# EAGLE design RF-antenna_B (EAGLE 9.2.2)

## Sheet 1 of 4
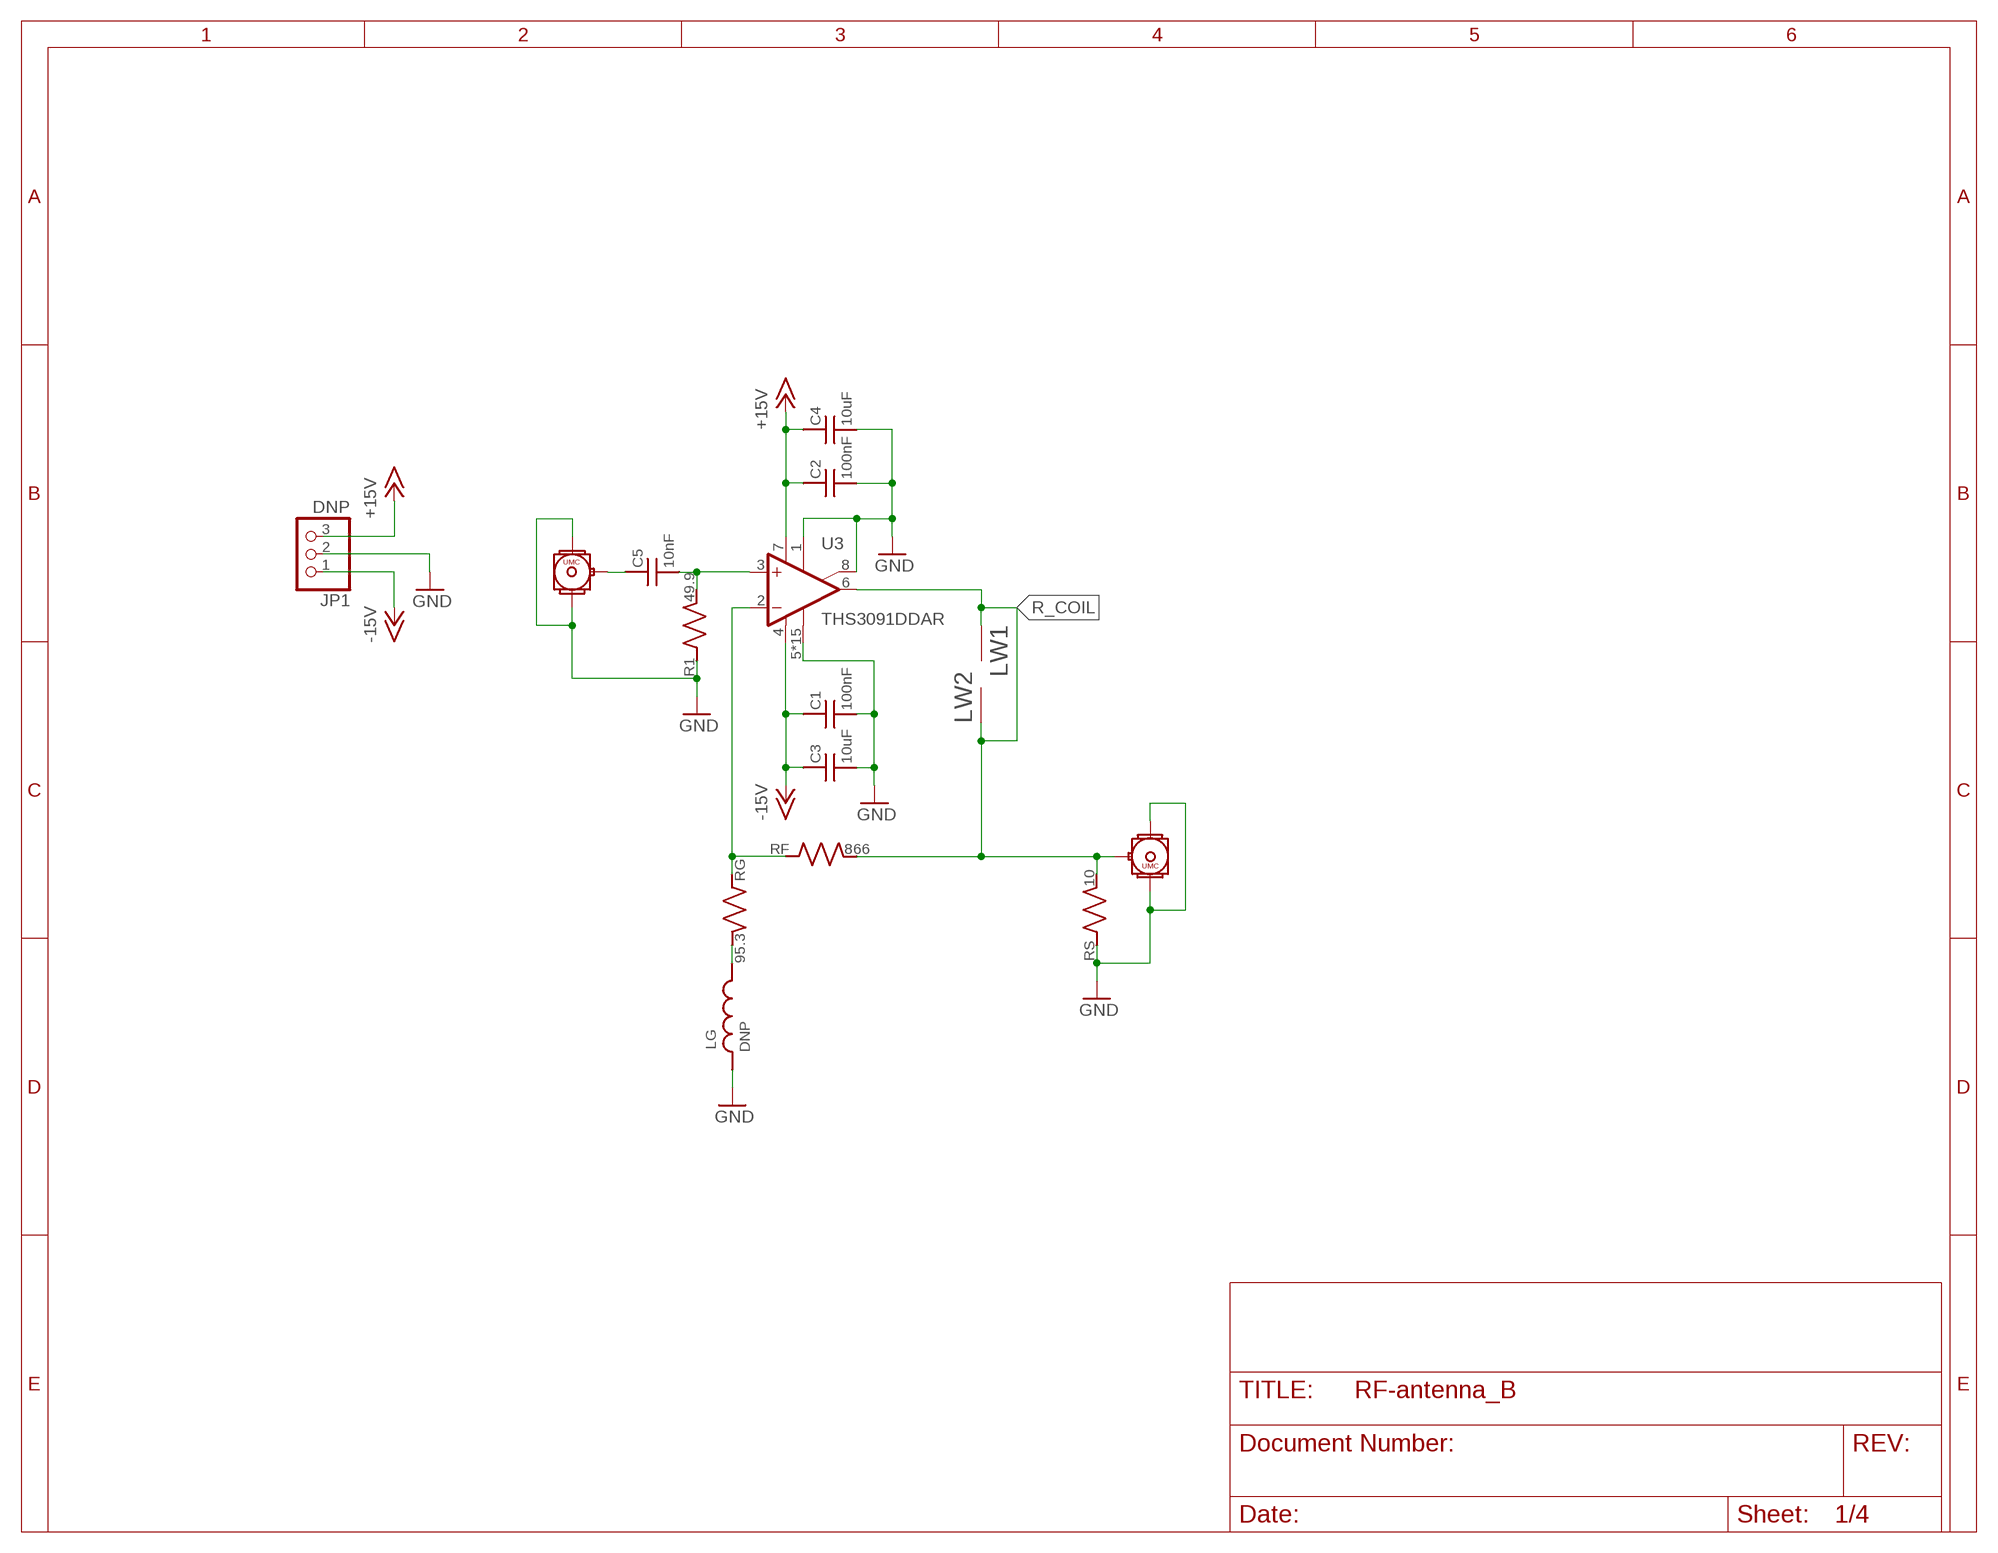
[diagram p0: schematic, sheet 1]

### Parts
C1  100nF  C_MLCC_SMDCMLCC_0603  [C_MLCC_0603]
C2  100nF  C_MLCC_SMDCMLCC_0603  [C_MLCC_0603]
C3  10uF  C_MLCC_SMDCMLCC_1206  [C_MLCC_1206]
C4  10uF  C_MLCC_SMDCMLCC_1206  [C_MLCC_1206]
C5  10nF  C_MLCC_SMDCMLCC_0402  [C_MLCC_0402]
CON1  UMC_CONNECTORREGULAR  [UMC_CONNECTOR]
CON2  UMC_CONNECTORREGULAR  [UMC_CONNECTOR]
JP1  DNP  PINHD-1X3  [1X03]
LG  DNP  L_FERRITE_SMD_1008  [1008]
LW1  LITZ_TERM  [LITZ_100MHZ]
LW2  LITZ_TERM  [LITZ_100MHZ]
R1  49.9  R_SMDR0402  [R_0402]
RF  866  R_SMDR0603  [R_0603]
RG  95.3  R_SMDR0402  [R_0402]
RS  10  R_SMDR1206  [R_1206]
U3  THS3091DDAR  [DDA8_2P28X2P28]

### Nets
+15V: C2.P$1 C4.P$1 JP1.3 U3.7(V+) ; also sheet 2,3
-15V: C1.P$1 C3.P$1 JP1.1 U3.4(V-) ; also sheet 2,3
GND: C1.P$2 C2.P$2 C3.P$2 C4.P$2 CON1.P$2 CON1.P$3 CON2.P$2 CON2.P$3 JP1.2 LG.P$1 R1.P$1 RS.P$1 U3.1(ON1) U3.5(OPT) U3.8(ON2) U3.EPAD(OPT) U3.P$1(OPT) U3.P$2(OPT) U3.P$3(OPT) U3.P$4(OPT) U3.P$5(OPT) U3.P$6(OPT) U3.P$7(OPT) U3.P$8(OPT) U3.P$9(OPT) U3.P$10(OPT) U3.P$11(OPT) U3.P$12(OPT) U3.P$13(OPT) ; also sheet 2,3
N$1: RF.P$1 RG.P$1 U3.2(-IN)
N$3: C5.P$2 R1.P$2 U3.3(+IN)
N$4: C5.P$1 CON2.P$1
N$6: LG.P$2 RG.P$2
R_COIL: CON1.P$1 LW1.T1(P1) LW2.T1(P1) RF.P$2 RS.P$2 U3.6(OUT)

## Sheet 2 of 4
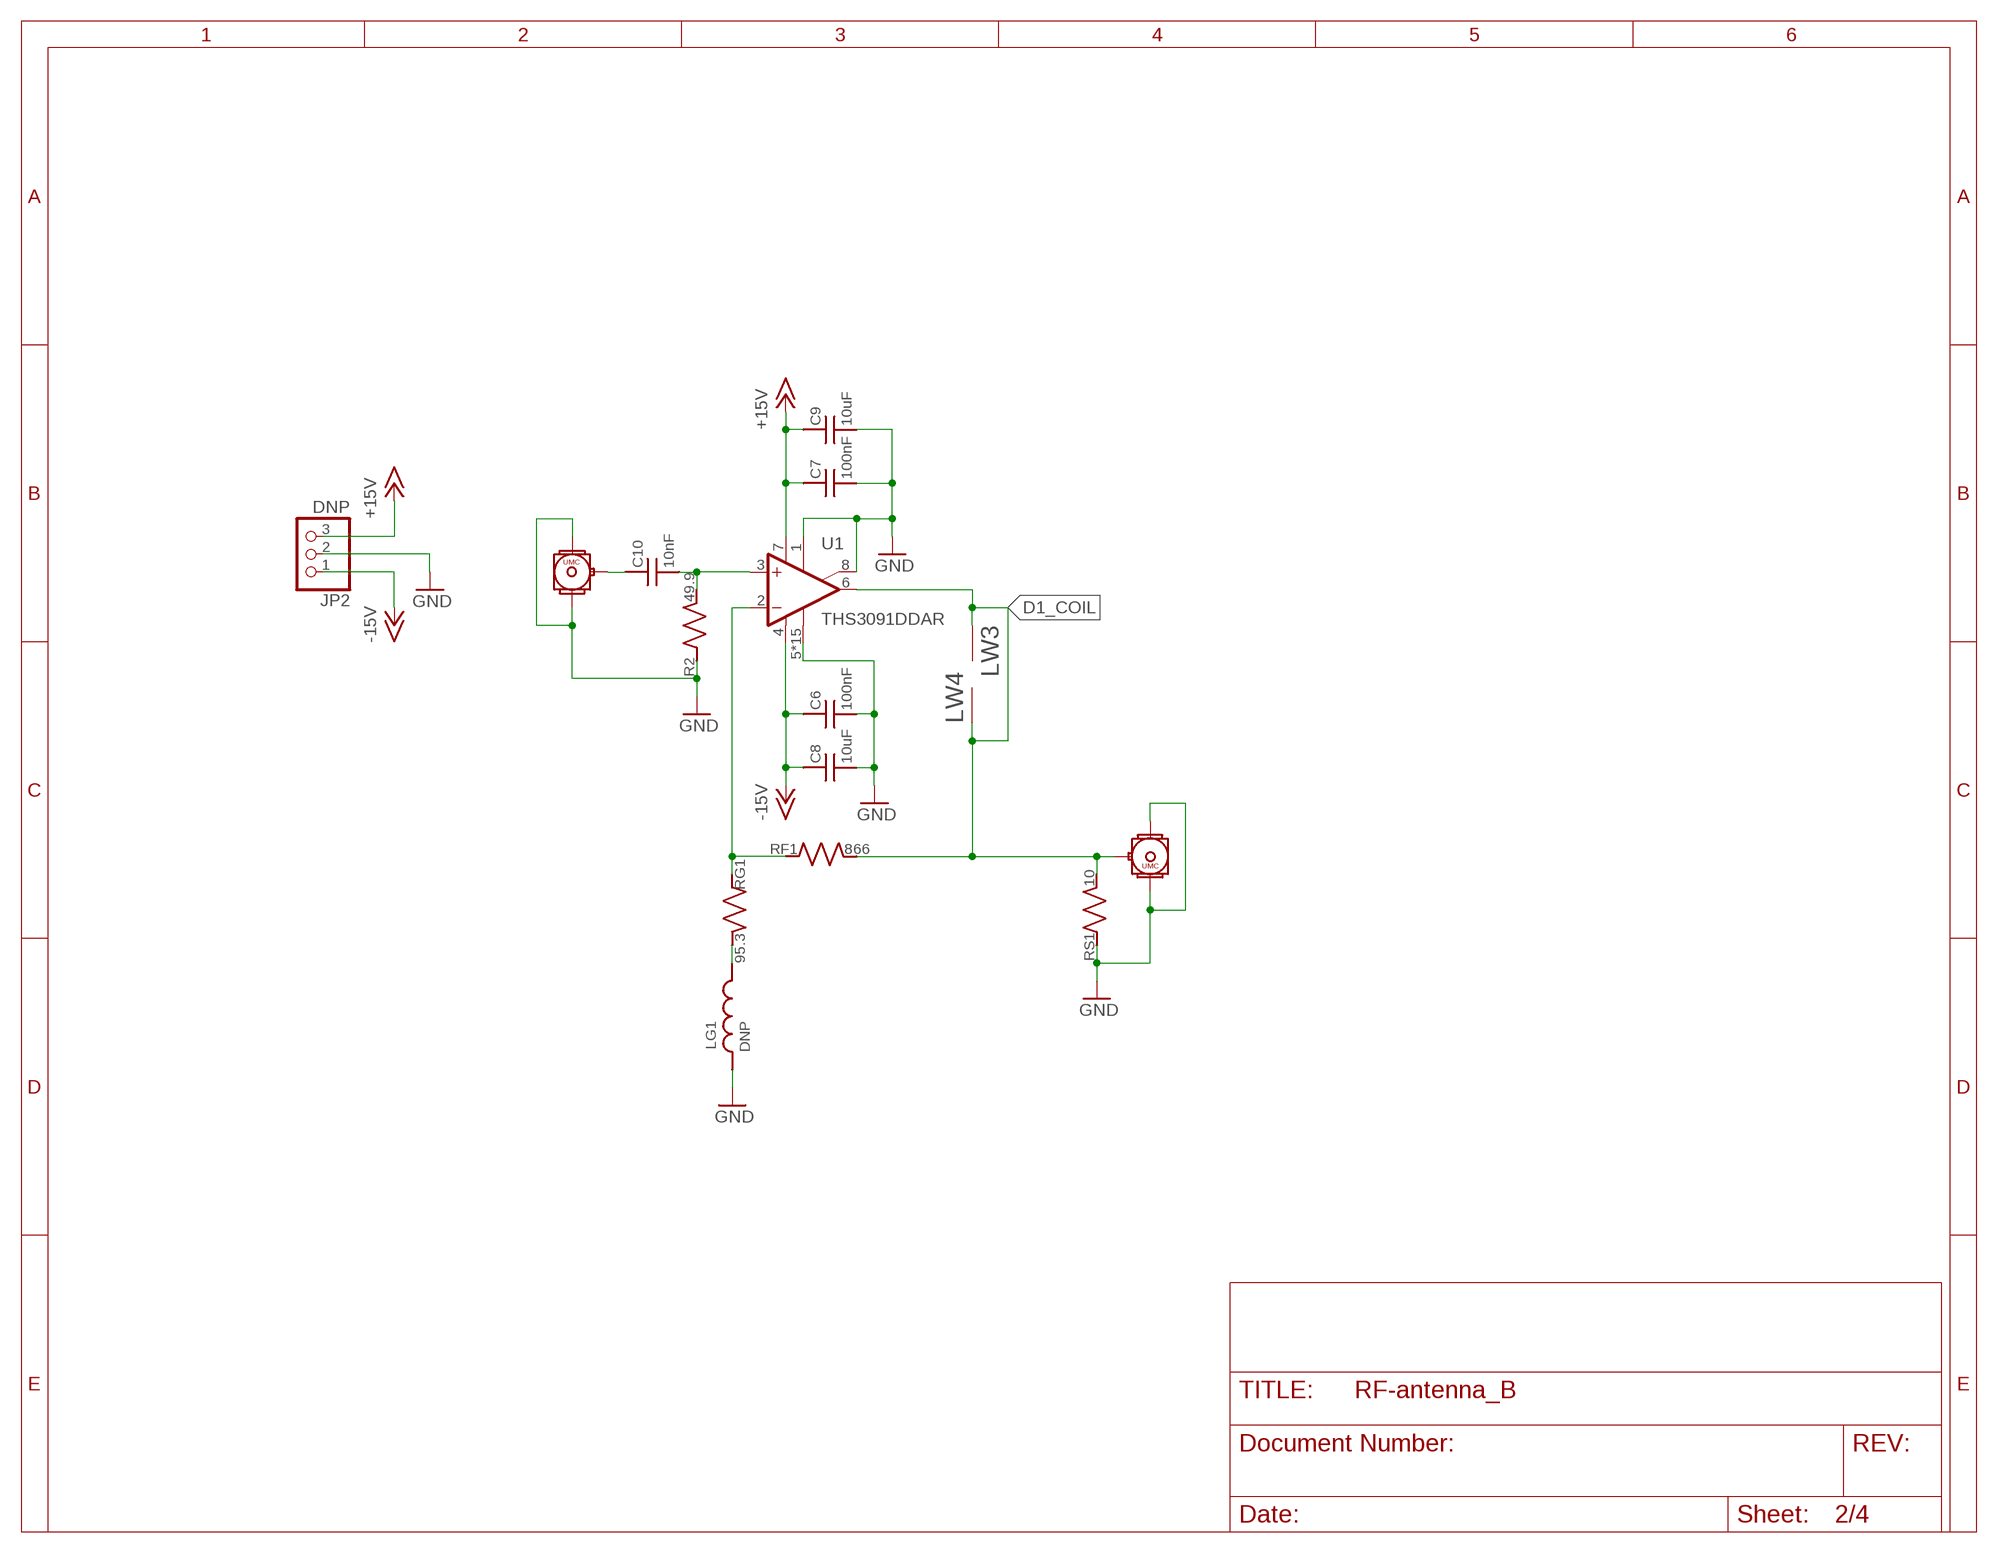
[diagram p1: schematic, sheet 2]

### Parts
C6  100nF  C_MLCC_SMDCMLCC_0603  [C_MLCC_0603]
C7  100nF  C_MLCC_SMDCMLCC_0603  [C_MLCC_0603]
C8  10uF  C_MLCC_SMDCMLCC_1206  [C_MLCC_1206]
C9  10uF  C_MLCC_SMDCMLCC_1206  [C_MLCC_1206]
C10  10nF  C_MLCC_SMDCMLCC_0402  [C_MLCC_0402]
CON3  UMC_CONNECTORREGULAR  [UMC_CONNECTOR]
CON4  UMC_CONNECTORREGULAR  [UMC_CONNECTOR]
JP2  DNP  PINHD-1X3  [1X03]
LG1  DNP  L_FERRITE_SMD_1008  [1008]
LW3  LITZ_TERM  [LITZ_100MHZ]
LW4  LITZ_TERM  [LITZ_100MHZ]
R2  49.9  R_SMDR0402  [R_0402]
RF1  866  R_SMDR0603  [R_0603]
RG1  95.3  R_SMDR0402  [R_0402]
RS1  10  R_SMDR1206  [R_1206]
U1  THS3091DDAR  [DDA8_2P28X2P28]

### Nets
+15V: C7.P$1 C9.P$1 JP2.3 U1.7(V+) ; also sheet 1,3
-15V: C6.P$1 C8.P$1 JP2.1 U1.4(V-) ; also sheet 1,3
D1_COIL: CON4.P$1 LW3.T1(P1) LW4.T1(P1) RF1.P$2 RS1.P$2 U1.6(OUT)
GND: C6.P$2 C7.P$2 C8.P$2 C9.P$2 CON3.P$2 CON3.P$3 CON4.P$2 CON4.P$3 JP2.2 LG1.P$1 R2.P$1 RS1.P$1 U1.1(ON1) U1.5(OPT) U1.8(ON2) U1.EPAD(OPT) U1.P$1(OPT) U1.P$2(OPT) U1.P$3(OPT) U1.P$4(OPT) U1.P$5(OPT) U1.P$6(OPT) U1.P$7(OPT) U1.P$8(OPT) U1.P$9(OPT) U1.P$10(OPT) U1.P$11(OPT) U1.P$12(OPT) U1.P$13(OPT) ; also sheet 1,3
N$5: RF1.P$1 RG1.P$1 U1.2(-IN)
N$7: C10.P$2 R2.P$2 U1.3(+IN)
N$8: C10.P$1 CON3.P$1
N$10: LG1.P$2 RG1.P$2

## Sheet 3 of 4
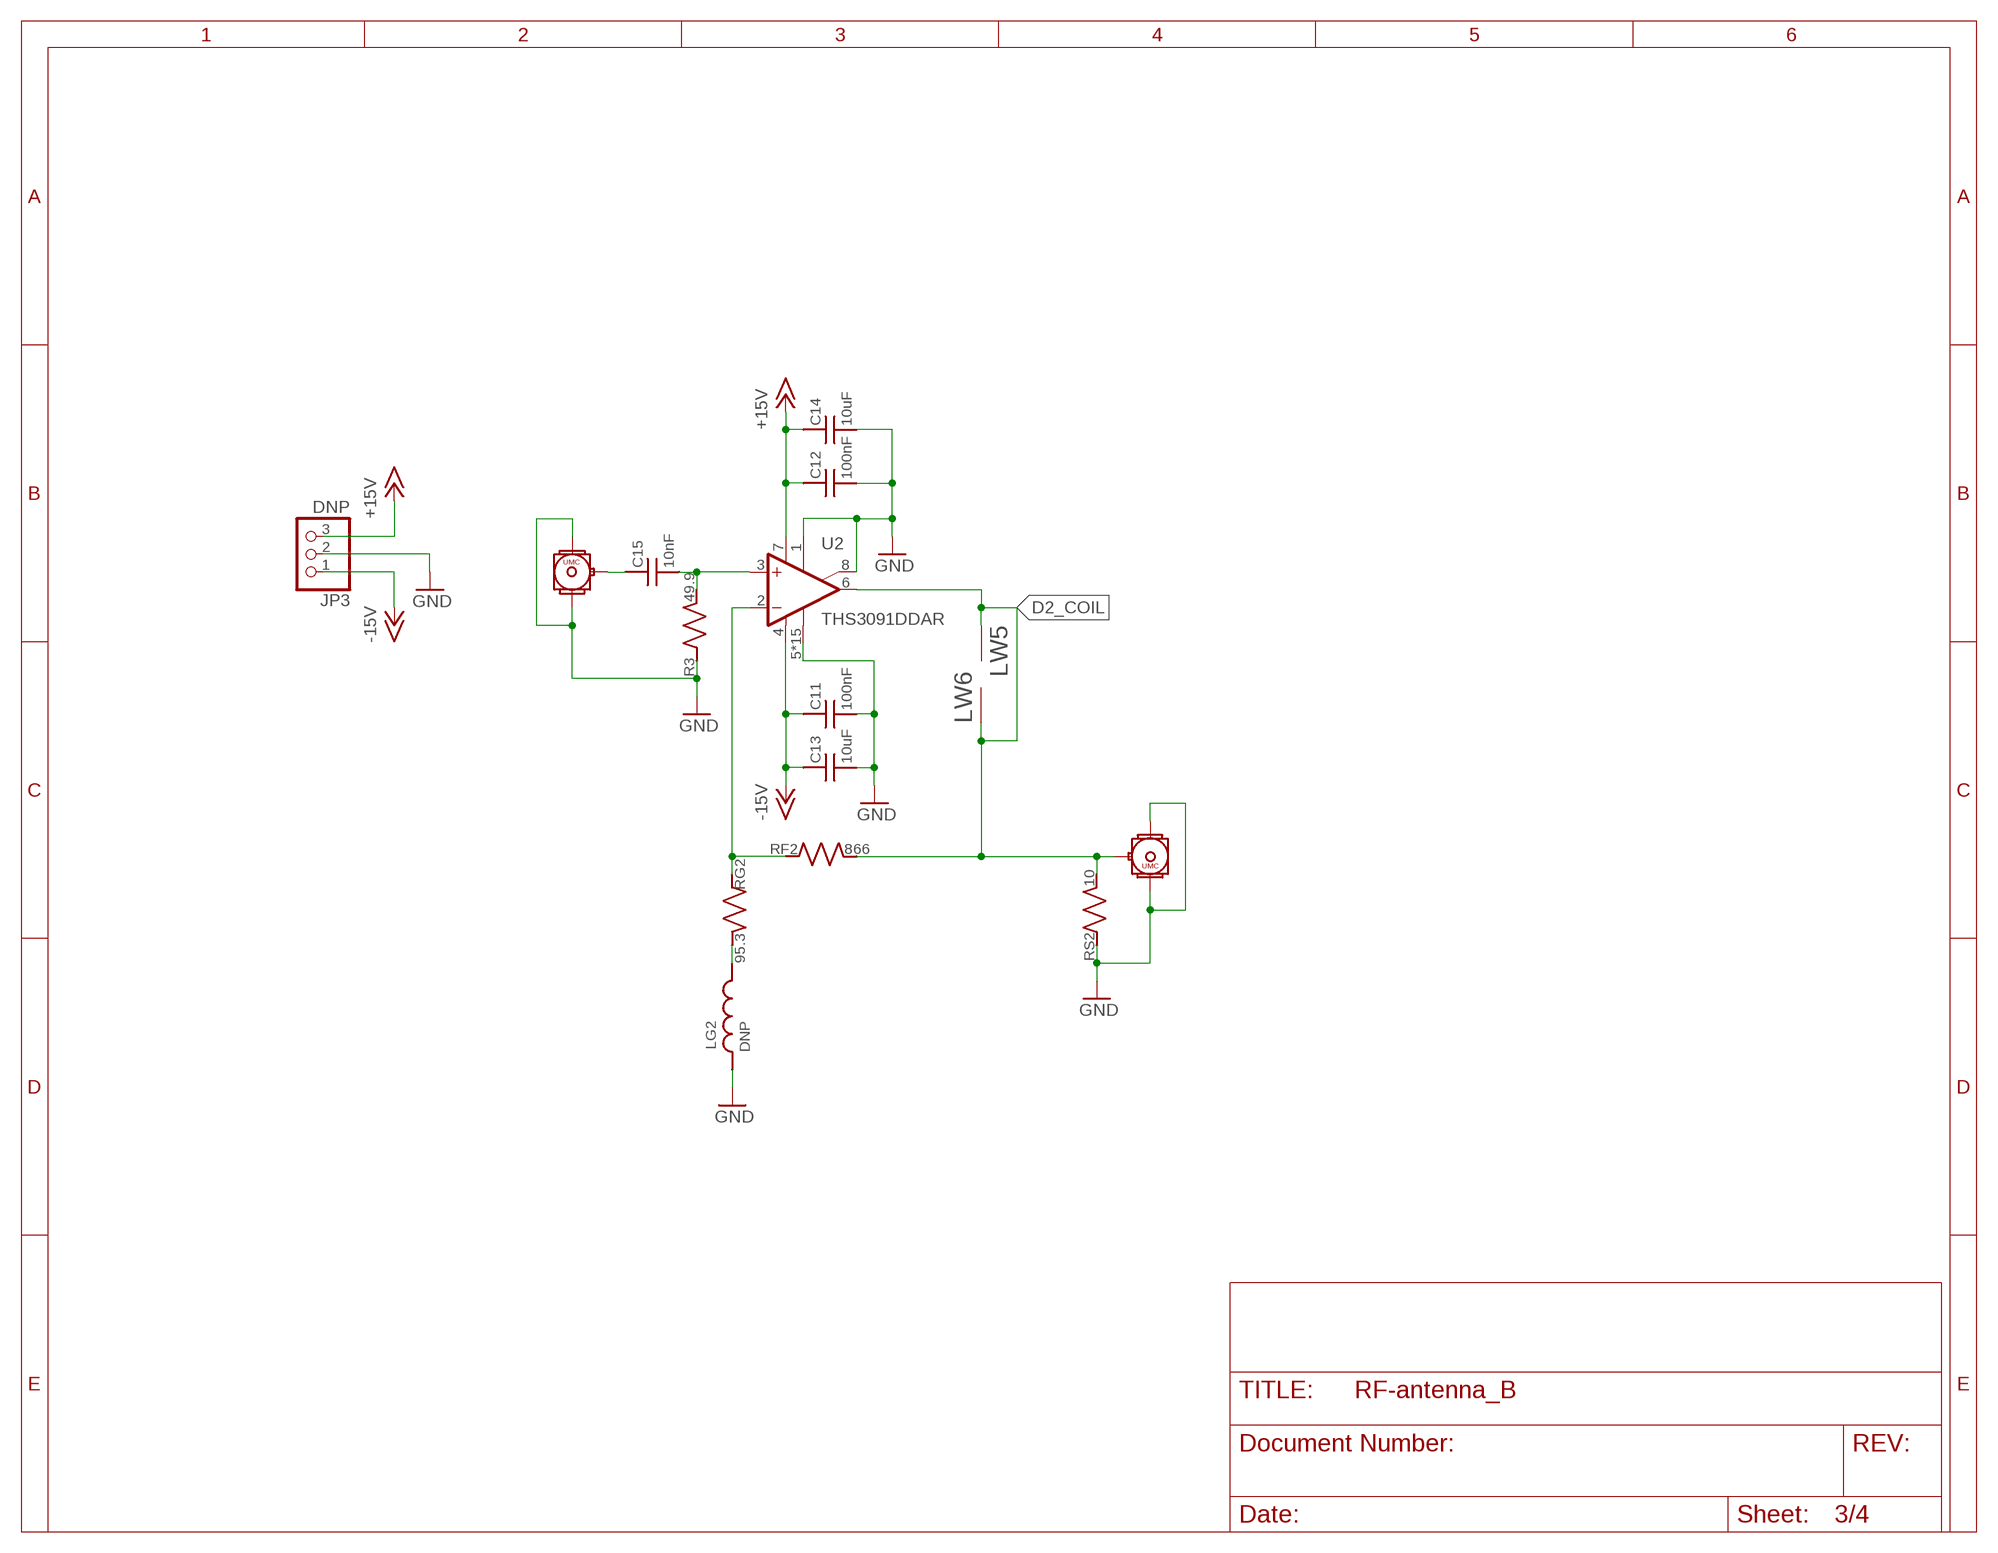
[diagram p2: schematic, sheet 3]

### Parts
C11  100nF  C_MLCC_SMDCMLCC_0603  [C_MLCC_0603]
C12  100nF  C_MLCC_SMDCMLCC_0603  [C_MLCC_0603]
C13  10uF  C_MLCC_SMDCMLCC_1206  [C_MLCC_1206]
C14  10uF  C_MLCC_SMDCMLCC_1206  [C_MLCC_1206]
C15  10nF  C_MLCC_SMDCMLCC_0402  [C_MLCC_0402]
CON5  UMC_CONNECTORREGULAR  [UMC_CONNECTOR]
CON6  UMC_CONNECTORREGULAR  [UMC_CONNECTOR]
JP3  DNP  PINHD-1X3  [1X03]
LG2  DNP  L_FERRITE_SMD_1008  [1008]
LW5  LITZ_TERM  [LITZ_100MHZ]
LW6  LITZ_TERM  [LITZ_100MHZ]
R3  49.9  R_SMDR0402  [R_0402]
RF2  866  R_SMDR0603  [R_0603]
RG2  95.3  R_SMDR0402  [R_0402]
RS2  10  R_SMDR1206  [R_1206]
U2  THS3091DDAR  [DDA8_2P28X2P28]

### Nets
+15V: C12.P$1 C14.P$1 JP3.3 U2.7(V+) ; also sheet 1,2
-15V: C11.P$1 C13.P$1 JP3.1 U2.4(V-) ; also sheet 1,2
D2_COIL: CON6.P$1 LW5.T1(P1) LW6.T1(P1) RF2.P$2 RS2.P$2 U2.6(OUT)
GND: C11.P$2 C12.P$2 C13.P$2 C14.P$2 CON5.P$2 CON5.P$3 CON6.P$2 CON6.P$3 JP3.2 LG2.P$1 R3.P$1 RS2.P$1 U2.1(ON1) U2.5(OPT) U2.8(ON2) U2.EPAD(OPT) U2.P$1(OPT) U2.P$2(OPT) U2.P$3(OPT) U2.P$4(OPT) U2.P$5(OPT) U2.P$6(OPT) U2.P$7(OPT) U2.P$8(OPT) U2.P$9(OPT) U2.P$10(OPT) U2.P$11(OPT) U2.P$12(OPT) U2.P$13(OPT) ; also sheet 1,2
N$11: RF2.P$1 RG2.P$1 U2.2(-IN)
N$12: C15.P$2 R3.P$2 U2.3(+IN)
N$13: C15.P$1 CON5.P$1
N$15: LG2.P$2 RG2.P$2

## Sheet 4 of 4
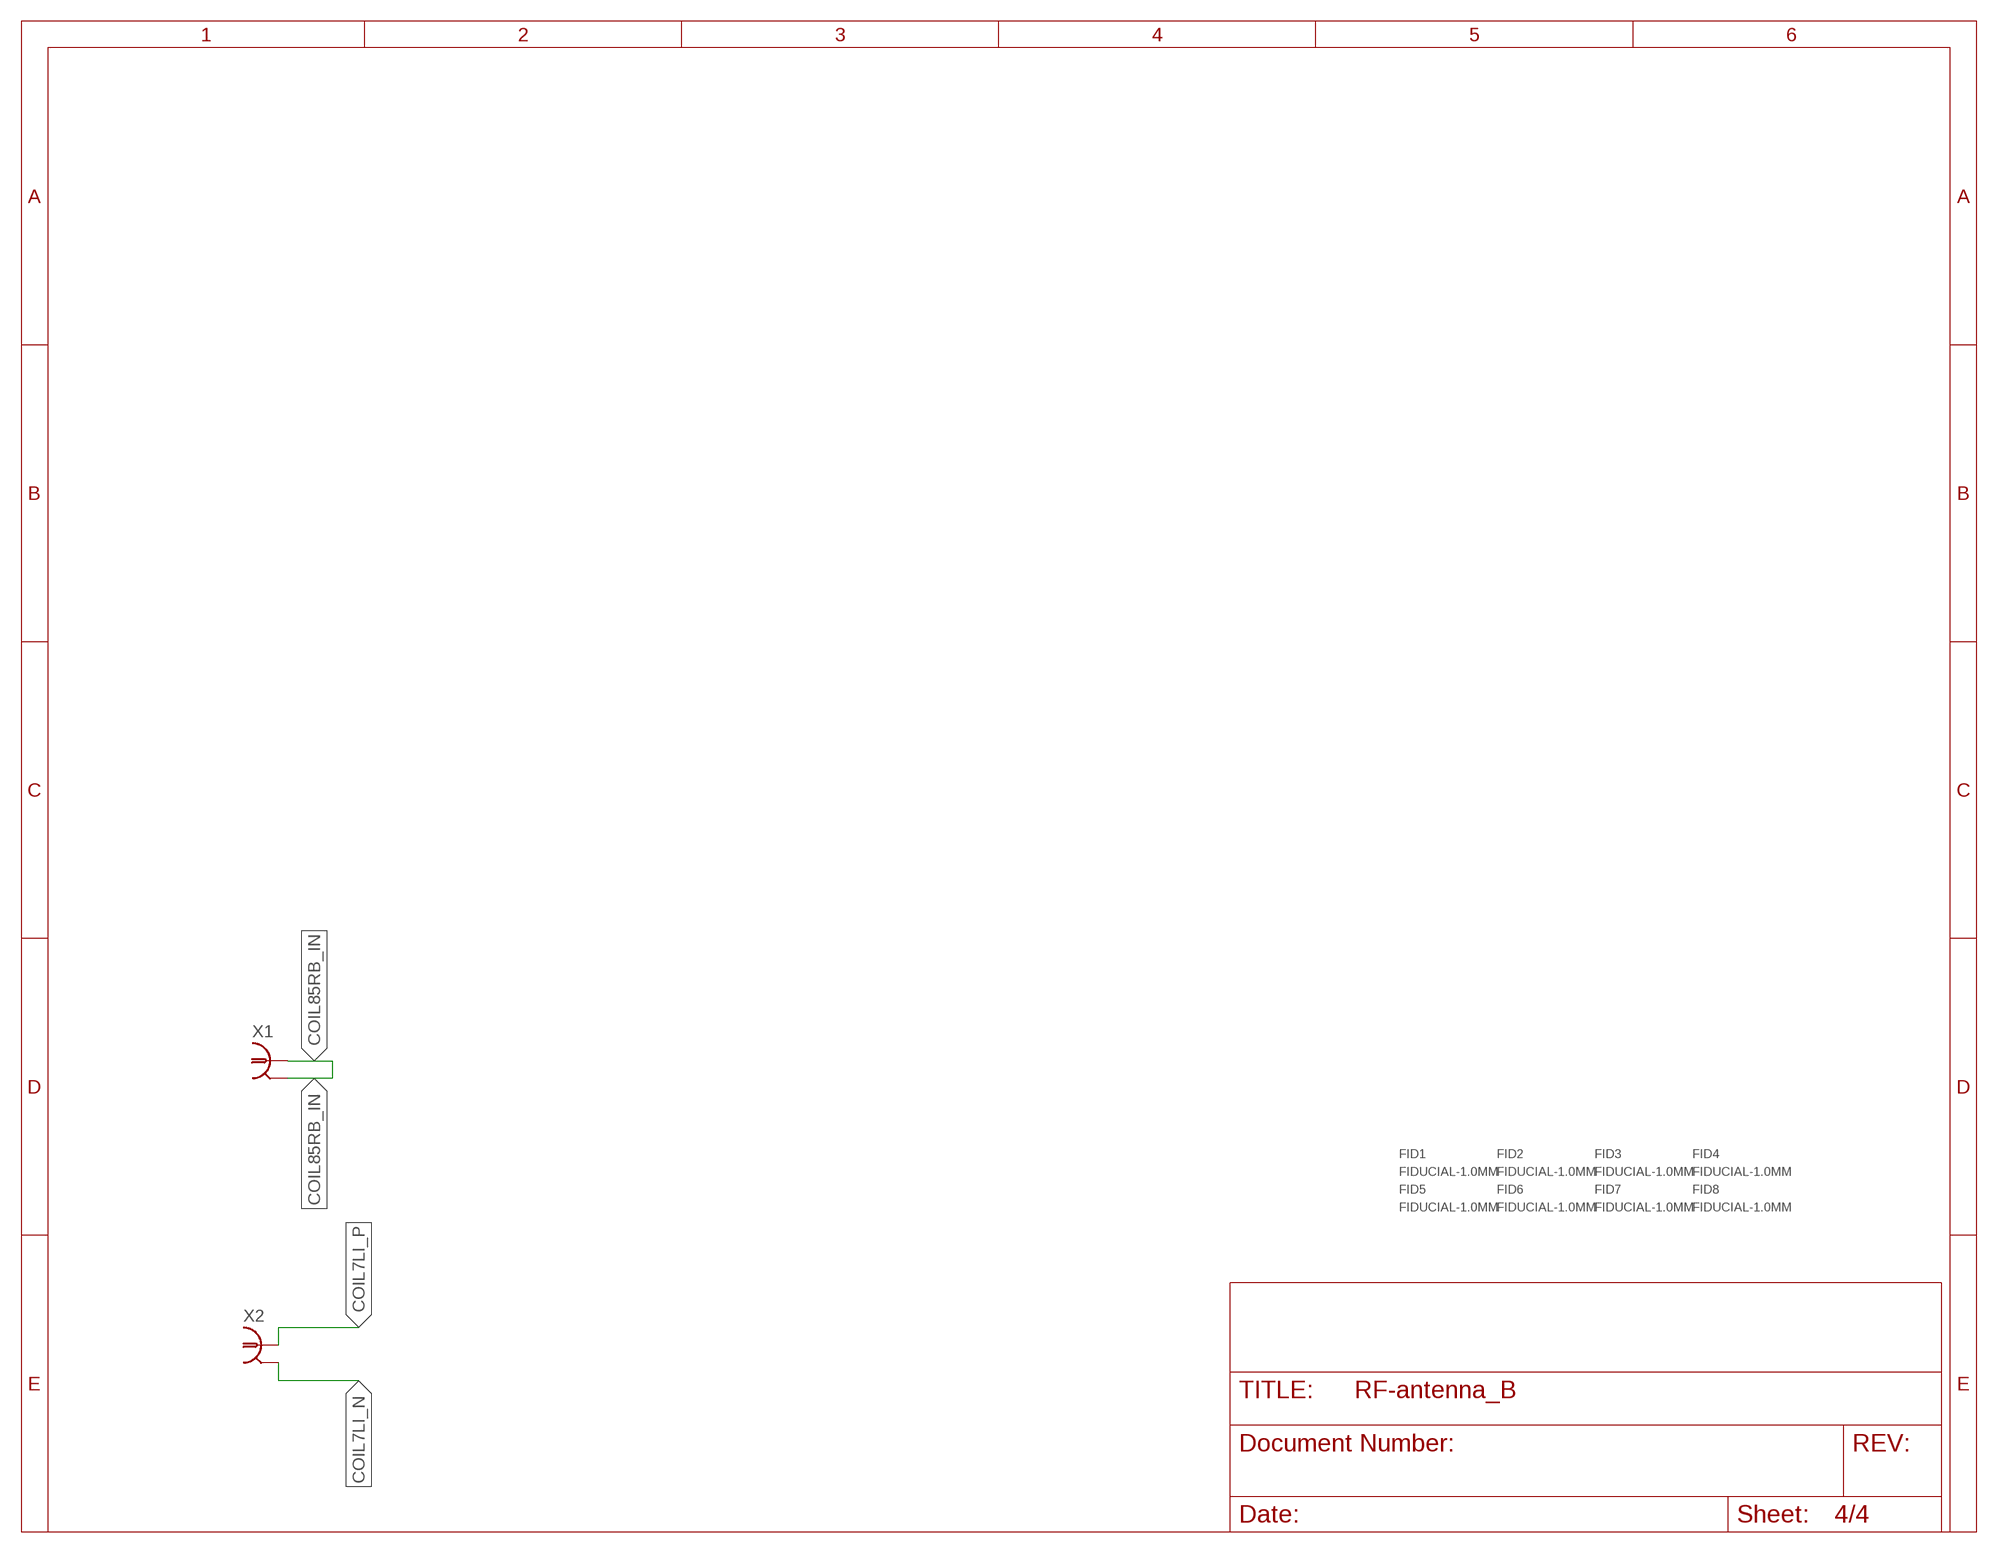
[diagram p3: schematic, sheet 4]

### Parts
FID1  FIDUCIAL-1.0MM  [FID_1.0MM]
FID2  FIDUCIAL-1.0MM  [FID_1.0MM]
FID3  FIDUCIAL-1.0MM  [FID_1.0MM]
FID4  FIDUCIAL-1.0MM  [FID_1.0MM]
FID5  FIDUCIAL-1.0MM  [FID_1.0MM]
FID6  FIDUCIAL-1.0MM  [FID_1.0MM]
FID7  FIDUCIAL-1.0MM  [FID_1.0MM]
FID8  FIDUCIAL-1.0MM  [FID_1.0MM]
X1  SMA-V  [SMA-V]
X2  SMA-V  [SMA-V]

### Nets
COIL7LI_N [coupled]: X2.GND1 X2.GND2 X2.GND3 X2.GND4
COIL7LI_P [coupled]: X2.RF
COIL85RB_IN: X1.GND1 X1.GND2 X1.GND3 X1.GND4 X1.RF

## Library data of the parts
C1 C2 C6 C7 C11 C12 = jqi_passives:C_MLCC_SMD; PARTNO: 06035C104K4Z2A
C3 C4 C8 C9 C13 C14 = jqi_passives:C_MLCC_SMD; PARTNO: C3216X5R1H106K160AB
C5 C10 C15 = jqi_passives:C_MLCC_SMD; PARTNO: CL05B103KB5NNNC
CON1-CON6 = qkdlab_alessandro:UMC_CONNECTOR; PARTNO: 1909763-1
FID1-FID8 = fiducials-jqi:FIDUCIAL: SMD Fiducials for optical recognition systems
JP1-JP3 = pinhead:PINHD-1X3: PIN HEADER; PARTNO: 640456-3
LG LG1 LG2 = jqi_passives:L_FERRITE_SMD
LW1-LW6 = RFantenna:LITZ_TERM: Simple Pad to use for drawing Litz wire.
R1-R3 = jqi_passives:R_SMD; PARTNO: ERA-2AEB49R9X
RF RF1 RF2 = jqi_passives:R_SMD; PARTNO: ERA-3AEB8660V
RG RG1 RG2 = jqi_passives:R_SMD; PARTNO: ERA-2AEB95R3X
RS RS1 RS2 = jqi_passives:R_SMD; PARTNO: PHP01206E10R0BST5
U1-U3 = opamp-jqi:THS3091DDAR; BUILT_BY: EMA_UL_Team; MANUFACTURER: Texas Instruments; MANUFACTURER_PART_NUMBER: THS3091DDAR; PARTNO: THS3091DDAR; VENDOR: Texas Instruments
X1 X2 = connector-jqi:SMA; PARTNO: 5-1814832-1

## Net classes
1 coupled: width 1.016 mm, clearance 0.381 mm

## Board
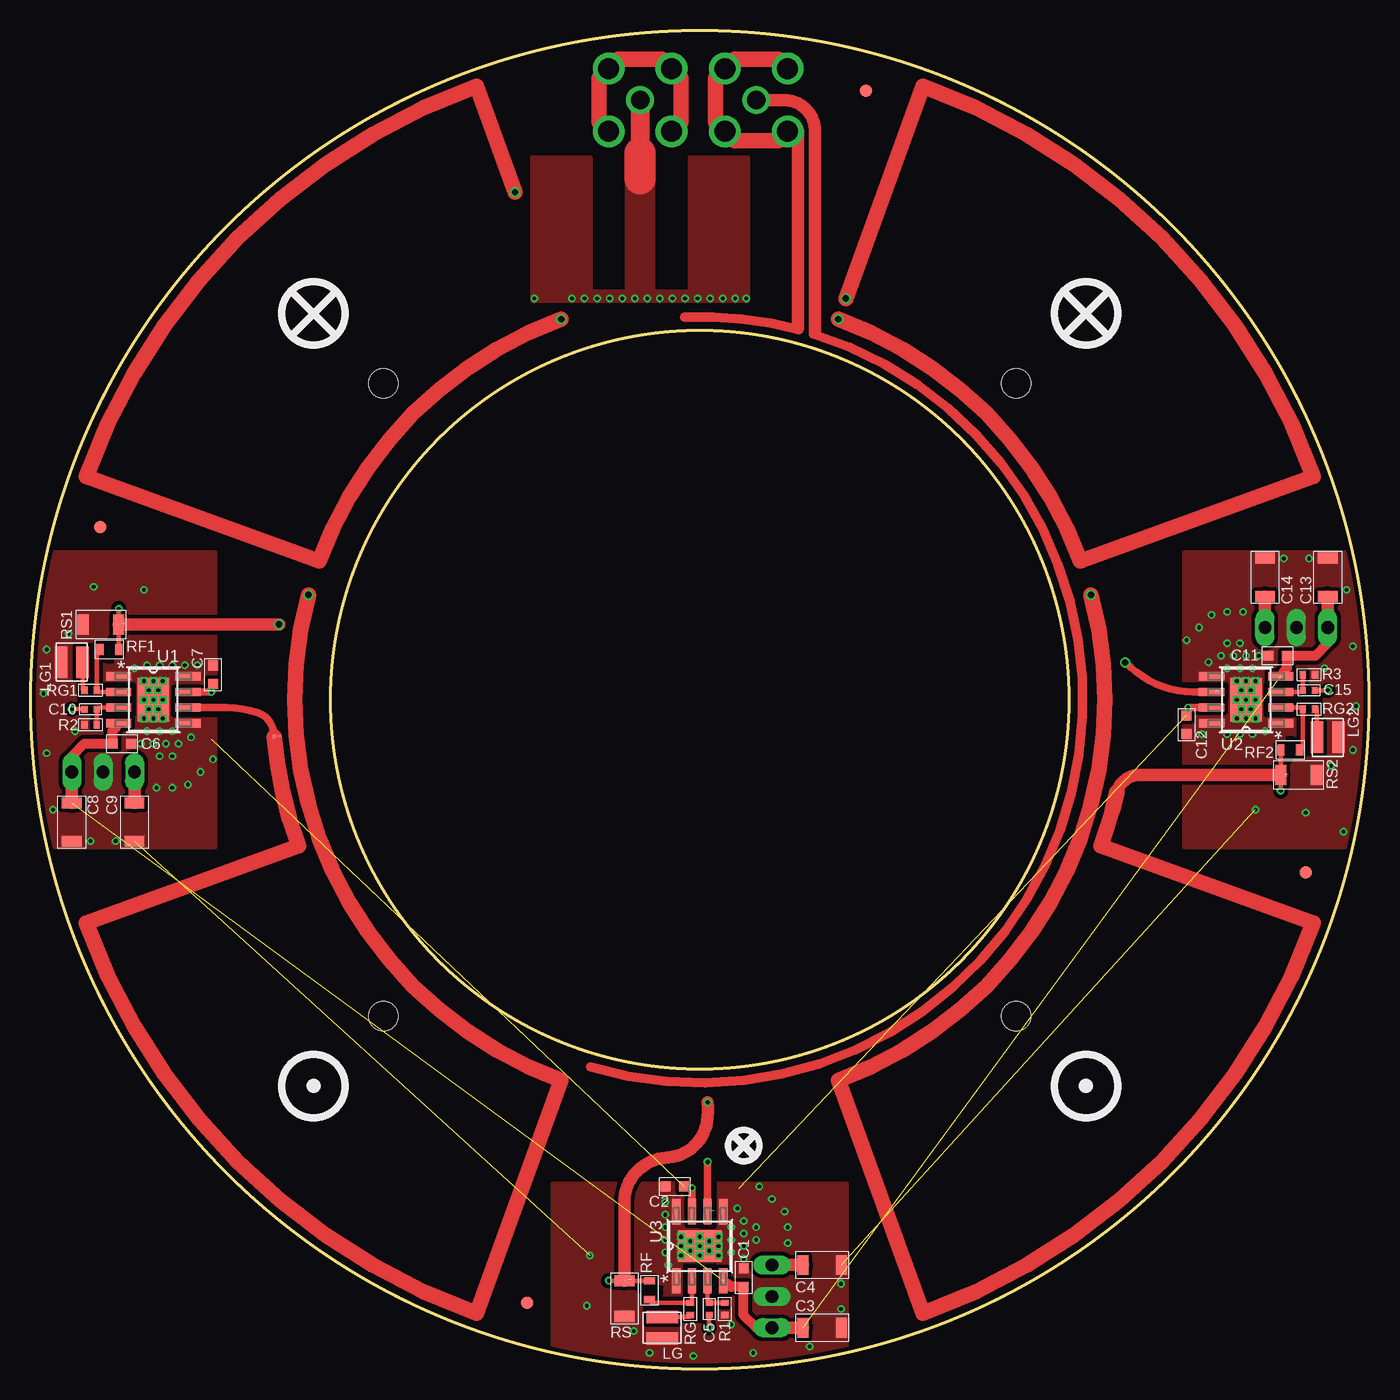
[diagram p4: board, top side]
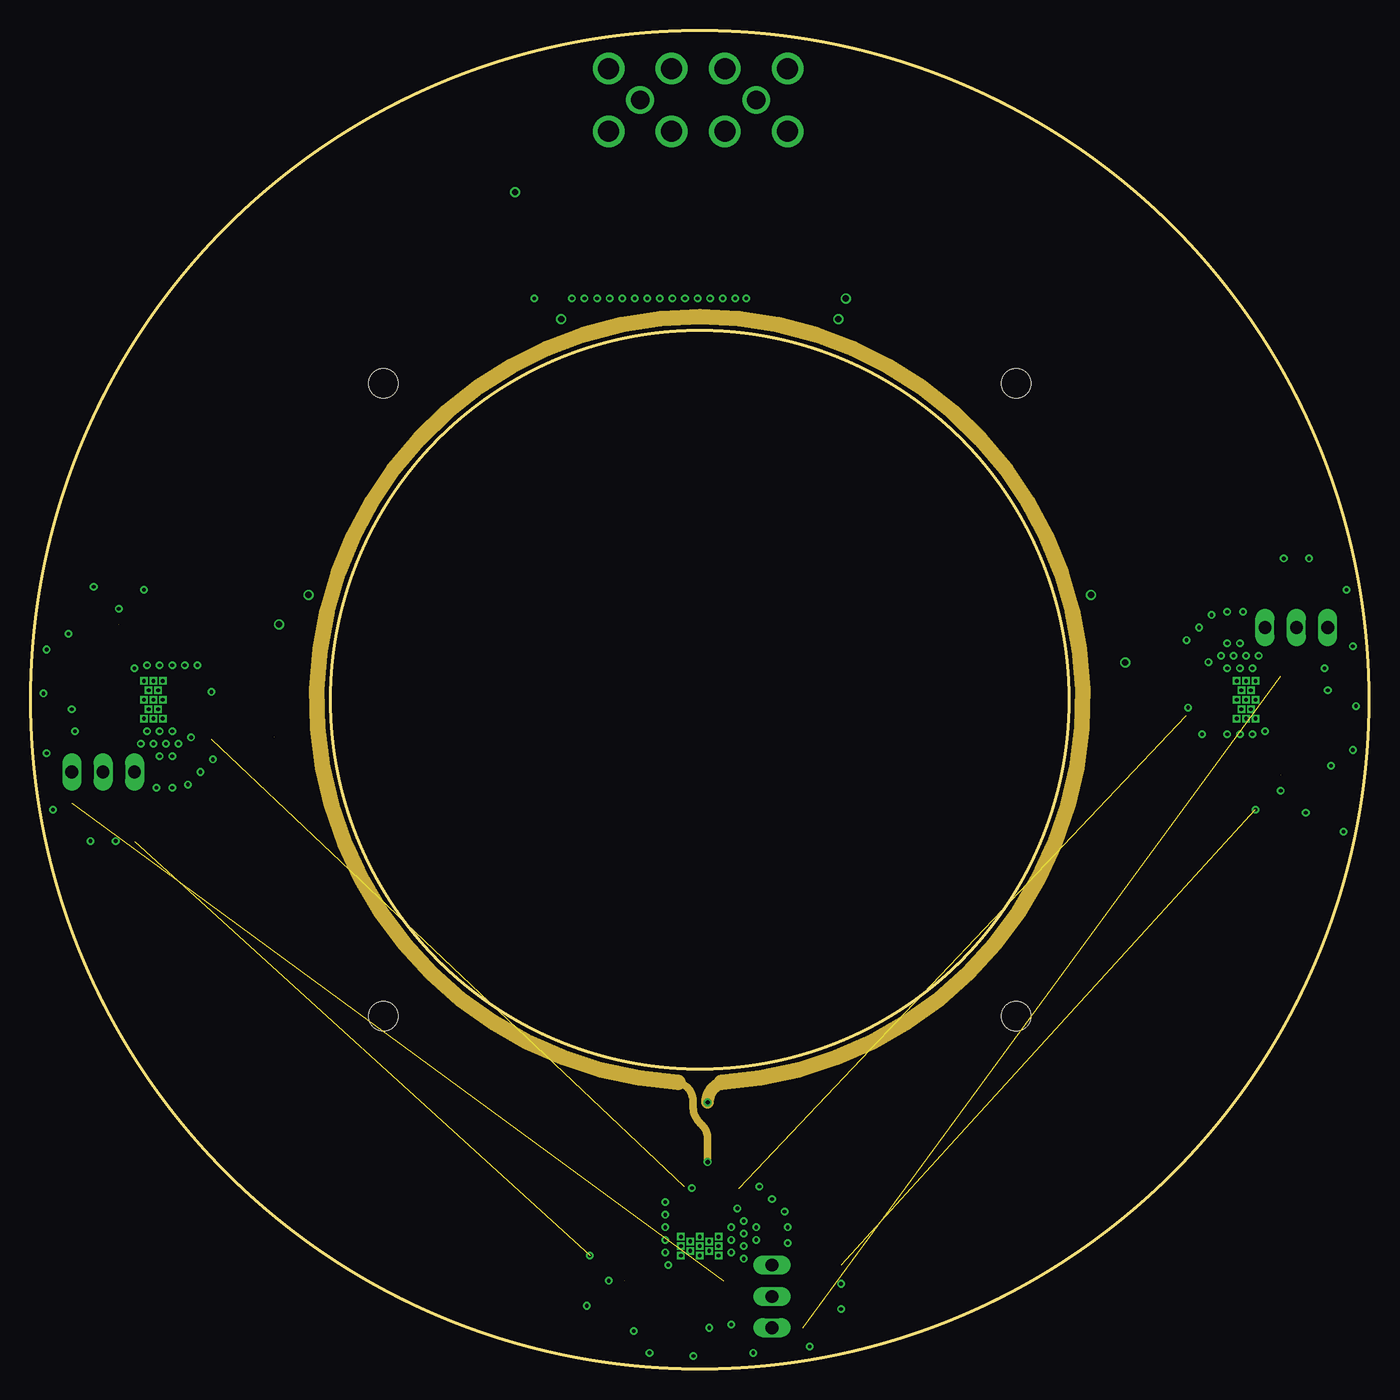
[diagram p5: board, inner layer Route2]
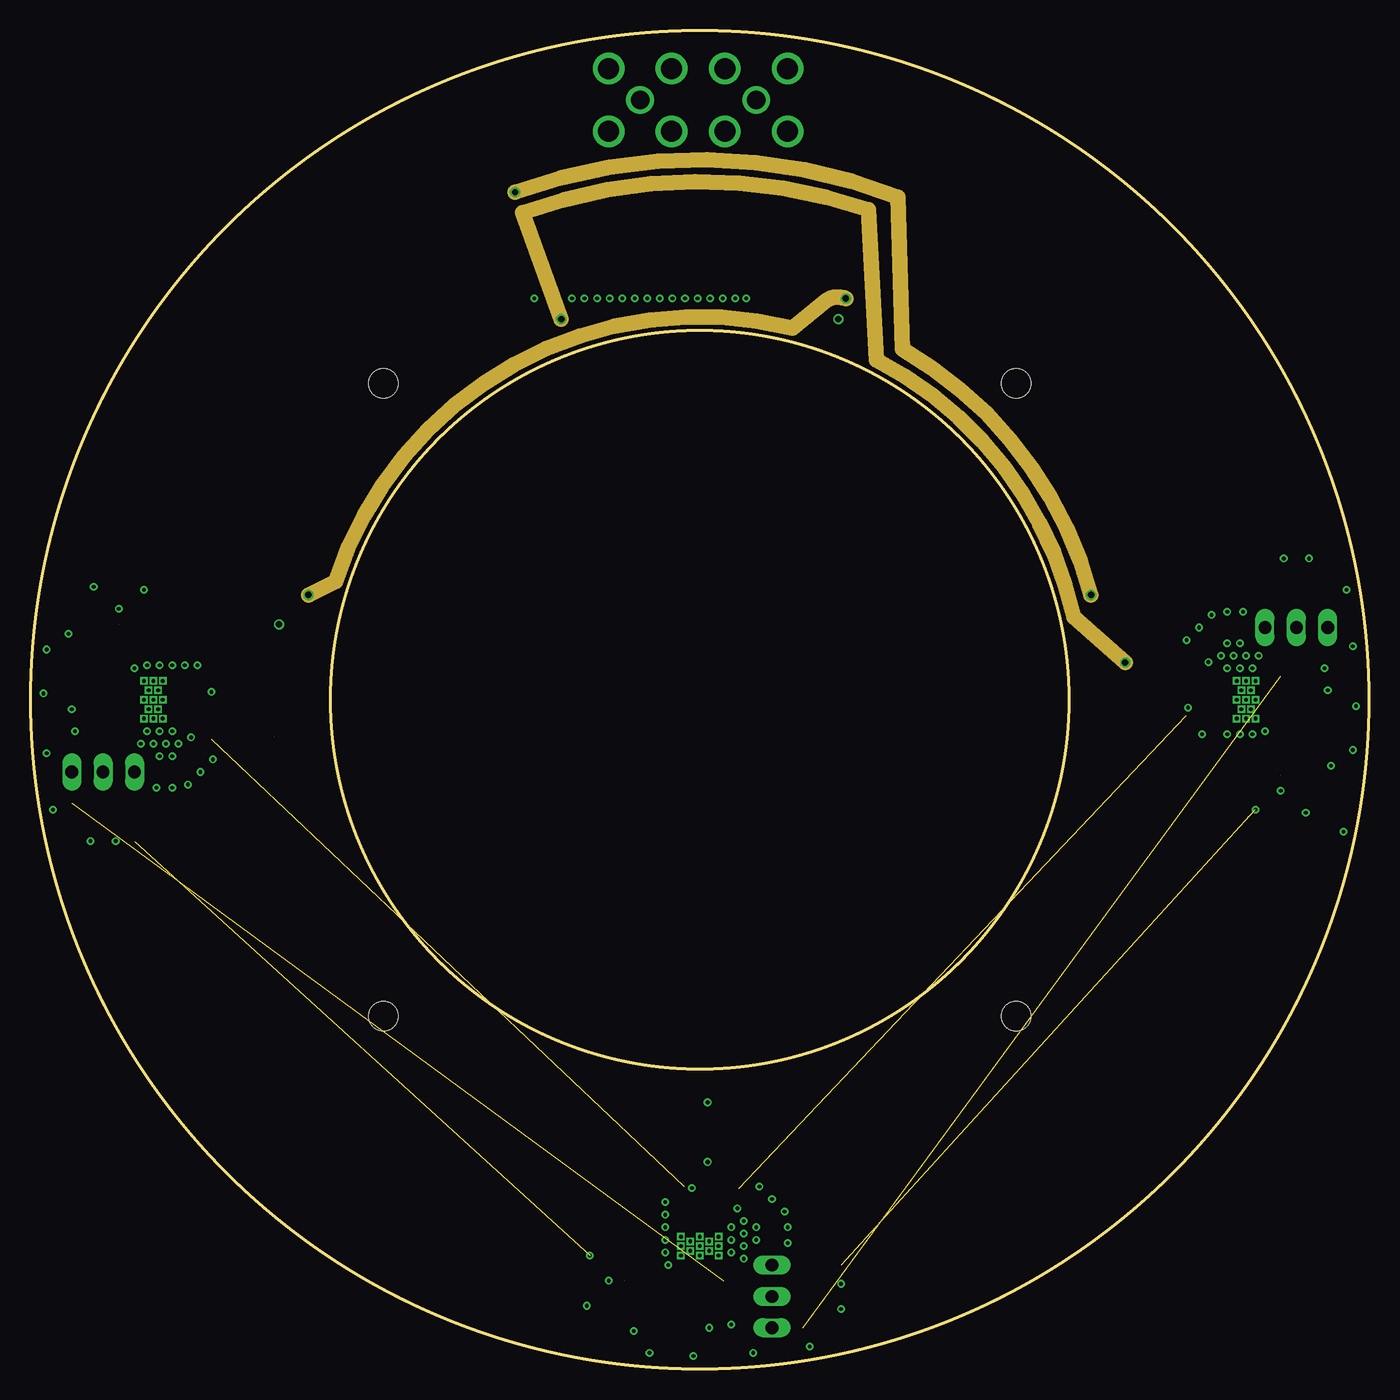
[diagram p6: board, inner layer Route15]
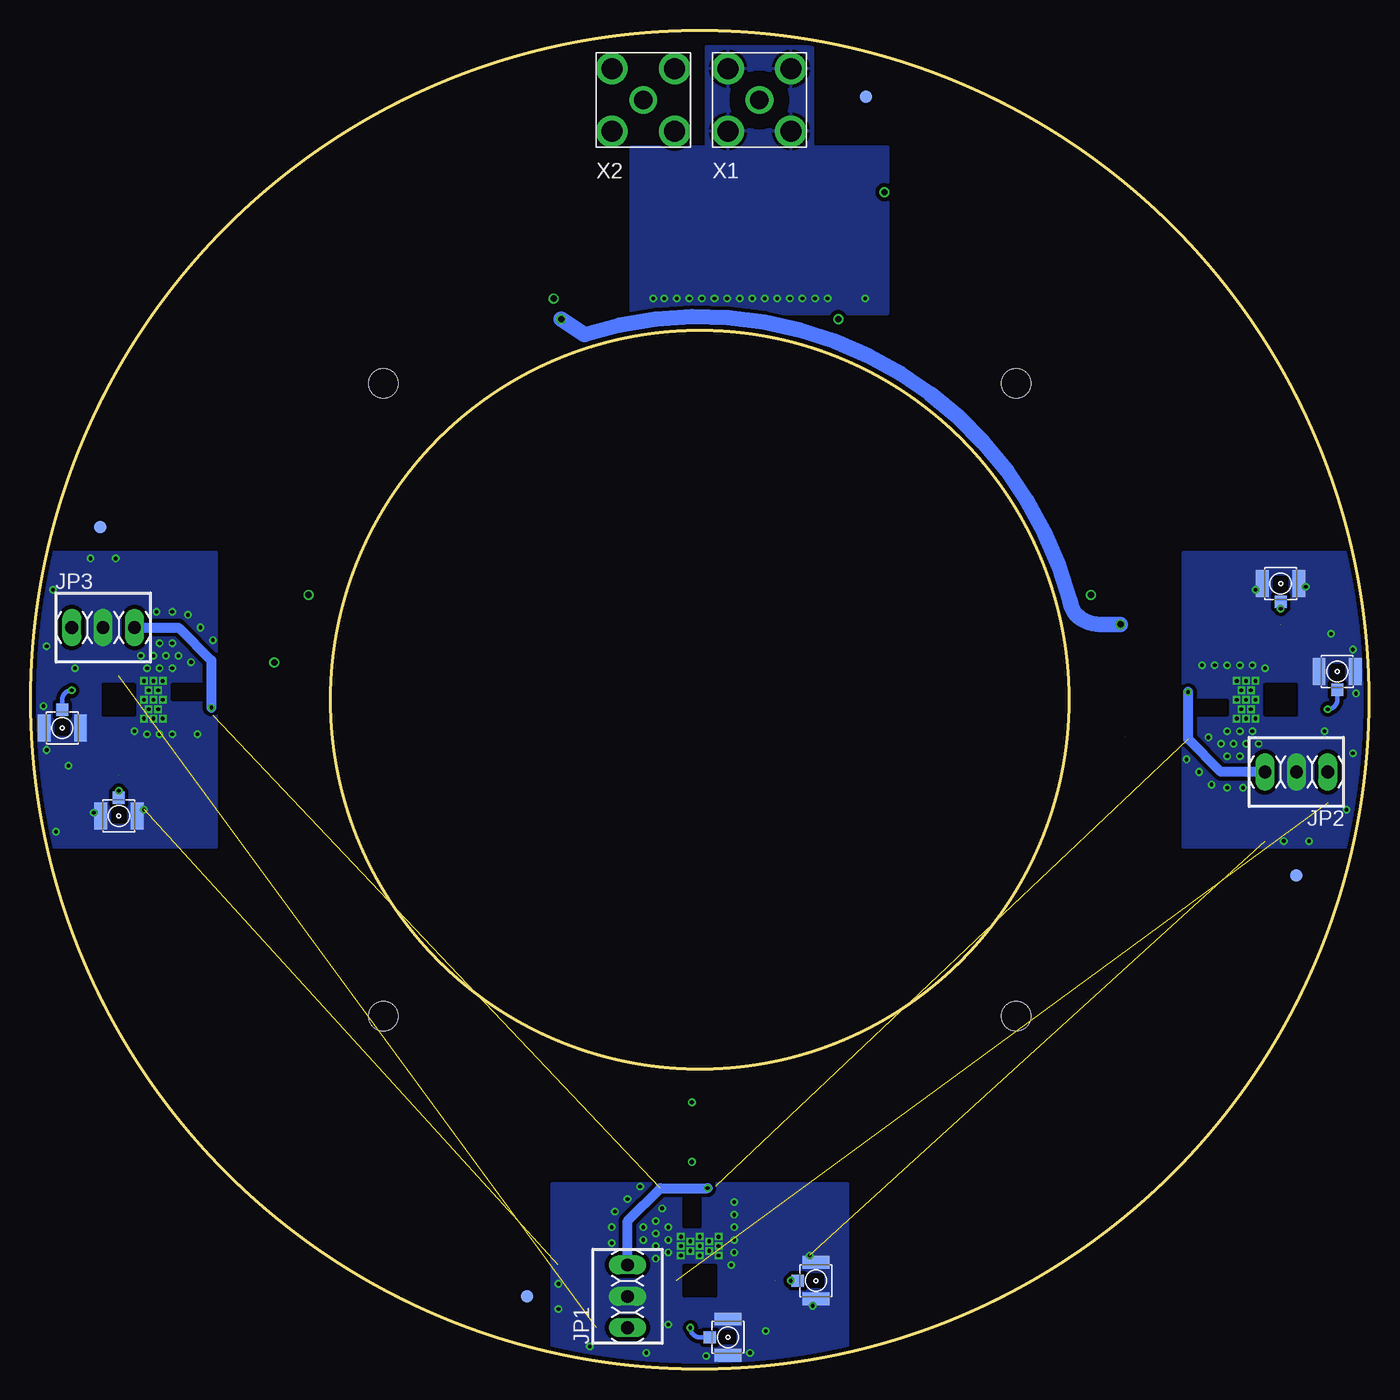
[diagram p7: board, bottom side, seen from below]

Size 108.2 x 108.2 mm. Coordinates in mm from the lower left corner, seen from the top.
Outline: circle at 54.1,54.1 radius 29.84
Outline: circle at 54.1,54.1 radius 54.1
Copper layers (1*2*15*16): Top 0.035mm / dielectric 0.23mm / Route2 0.035mm / dielectric 0.93mm / Route15 0.035mm / dielectric 0.23mm / Bottom 0.035mm
Design rules "MF_Standard_4_Layer *": minimum track width 5mil, minimum drill 12mil, track to track 5mil, track to pad 5mil, pad to pad 5mil, via to via 5mil, smd to smd 0mil, copper to edge 10mil, drill to drill 10mil, minimum pad ring 6mil, minimum via ring 6mil, stop-mask expansion 2mil, vias tented up to drill 25mil, thermal gap 10mil
Holes 2.37 mm at 79.71,79.71 79.71,28.5 28.5,28.5 28.5,79.71
tKeepout: 4 lines
bKeepout: area 42.2,96.8 to 66,108.2; area 42.2,0 to 66,11.4; area 0,42.2 to 11.4,66; area 96.8,42.2 to 108.2,66

### Footprints (pad centres in the part's own frame; a part is rotated, then mirrored left to right if it is on the bottom)
C_MLCC_0603 = smd 0.8 x 0.8: P$1 -0.75,0; P$2 0.75,0
C_MLCC_1206 = smd 0.9 x 1.6: P$1 -1.55,0; P$2 1.55,0
C_MLCC_0402 = smd 0.5 x 0.5: P$1 -0.5,0; P$2 0.5,0
UMC_CONNECTOR = smd 1.041 x 0.991: P$1 1.473,0 | smd 2.21 x 1.041: P$2 0,1.473; P$3 0,-1.473
FID_1.0MM = smd 1 x 1: FID 0,0
1X03 = drill 1.016 long: 1 -2.54,0; 2 0,0; 3 2.54,0
1008 = smd 2.54 x 1.016: P$1 0,-0.876; P$2 0,0.876
LITZ_100MHZ = smd 0.254 x 0.254: T1 0,0
R_0402 = smd 0.5 x 0.6: P$1 -0.5,0; P$2 0.5,0
R_0603 = smd 0.6 x 0.9: P$1 -0.75,0; P$2 0.75,0
R_1206 = smd 0.9 x 1.6: P$1 -1.45,0; P$2 1.45,0
DDA8_2P28X2P28 = smd 2.032 x 0.66: 1 -2.794,1.905; 2 -2.794,0.635; 3 -2.794,-0.635; 4 -2.794,-1.905; 5 2.794,-1.905; 6 2.794,-0.635; 7 2.794,0.635; 8 2.794,1.905 | smd 2.54 x 3.556: EPAD 0,0 | drill 0.305 square: P$1 0,0; P$2 -0.762,0; P$3 0.762,0; P$4 0.762,-1.524; P$5 0,-1.524; P$6 -0.762,-1.524; P$7 -0.762,1.524; P$8 0,1.524; P$9 0.762,1.524; P$10 0.381,0.762; P$11 -0.381,0.762; P$12 -0.381,-0.762; P$13 0.381,-0.762
SMA-V = drill 1.702: GND1 -2.54,2.54; GND2 2.54,2.54; GND3 2.54,-2.54; GND4 -2.54,-2.54 | drill 1.499: RF 0,0

### Placement (x,y rotation side)
C1  57.66,7.37 90 top
C2  52.07,14.73 180 top
C3  64.01,3.3 0 top
C4  64.01,8.38 0 top
C5  54.86,4.83 90 top
C6  7.37,50.55 0 top
C7  14.73,56.13 90 top
C8  3.3,44.2 270 top
C9  8.38,44.2 270 top
C10  4.83,53.34 0 top
C11  100.84,57.66 180 top
C12  93.47,52.07 270 top
C13  104.9,64.01 90 top
C14  99.82,64.01 90 top
C15  103.38,54.86 180 top
CON1  44.7,7.11 180 bottom
CON2  51.82,2.54 180 bottom
CON3  2.54,56.39 270 bottom
CON4  7.11,63.5 270 bottom
CON5  105.66,51.82 90 bottom
CON6  101.09,44.7 90 bottom
FID1  5.59,68.07 0 top
FID2  40.13,5.33 0 top
FID3  103.12,40.13 0 top
FID4  67.56,103.38 0 top
FID5  68.07,5.84 0 bottom
FID6  40.64,102.87 0 bottom
FID7  5.84,39.88 0 bottom
FID8  102.62,68.07 0 bottom
JP1  59.94,5.84 90 bottom
JP2  5.84,48.26 180 bottom
JP3  102.36,59.94 0 bottom
LG  51.05,3.3 0 top
LG1  3.3,57.15 270 top
LG2  104.9,51.05 90 top
LW1  54.74,12.7 0 top
LW2  48.01,7.11 0 top
LW3  19.68,51.1 0 top
LW4  7.11,60.2 0 top
LW5  95.5,54.74 0 top
LW6  101.09,48.01 0 top
R1  56.13,4.83 90 top
R2  4.83,52.07 0 top
R3  103.38,56.13 180 top
RF  50.04,6.35 90 top
RF1  6.35,58.17 0 top
RF2  101.85,50.04 180 top
RG  53.34,4.83 270 top
RG1  4.83,54.86 180 top
RG2  103.38,53.34 0 top
RS  48.01,5.66 90 top
RS1  5.66,60.2 0 top
RS2  102.54,48.01 180 top
U1  9.91,54.1 0 top
U2  98.3,54.1 180 top
U3  54.1,9.91 90 top
X1  49.28,102.62 0 bottom
X2  58.67,102.62 0 bottom

### Tracks (layer width: path | path; a pad name or v marks a point on that pad's centre or on a via)
+15V  (via drill 0.3)  (2 unrouted)
  Top 0.61: U3.7 v53.47,14.6 53.47,14.48 C2.P$1 | U1.7 v14.6,54.74 14.48,54.74 C7.P$1 | U2.7 v93.61,53.47 93.73,53.47 C12.P$1
  Top 1.016: JP1.3 C4.P$1 | JP2.3 C9.P$1 | JP3.3 C14.P$1
  Bottom 0.813: JP1.3 59.94,11.94 57.28,14.6 v53.47,14.6 | JP2.3 11.94,48.26 14.6,50.92 v14.6,54.74 | JP3.3 96.27,59.94 93.61,57.28 v93.61,53.47
-15V  (2 unrouted)
  Top 0.61: 56.39,6.86 56.13,7.11 U3.4 | 6.86,51.82 7.11,52.07 U1.4 | 101.35,56.39 101.09,56.13 U2.4
  Top 0.813: JP1.1 58.67,3.3 57.66,4.32 C1.P$1 56.63,6.62 56.39,6.86 | JP2.1 3.3,49.53 4.32,50.55 C6.P$1 6.62,51.57 6.86,51.82 | JP3.1 104.9,58.67 103.89,57.66 C11.P$1 101.59,56.63 101.35,56.39
  Top 1.016: JP1.1 C3.P$1 | JP2.1 C8.P$1 | JP3.1 C13.P$1
COIL7LI_N
  Top 0.254: 62.04,84.18 62.12,84.03
  Top 0.762: 62.12,84.03 arc17 52.87,85.06
  Top 1.016: X2.GND4 62.04,100.08 62.04,84.18
  Top 1.27: X2.GND1 60.45,105.92 56.9,105.92 X2.GND2 55.37,104.39 55.37,100.84 X2.GND3 56.9,99.31 60.45,99.31 X2.GND4
COIL7LI_P
  Top 0.254: 63.44,83.78 63.29,83.7
  Top 0.762: 63.29,83.7 arc-179 45.28,24.39
  Top 1.016: X2.RF 60.9,102.62 arc-90 63.44,100.08 63.44,83.78
COIL85RB_IN  (via drill 0.3)
  Top 1.27: X1.GND4 52.58,100.84 52.58,104.39 X1.GND1 51.05,105.92 47.5,105.92 X1.GND2 45.97,104.39 45.97,100.84 X1.GND3
  Top 1.524: X1.RF 49.28,98.3
  Top 2.54: 49.28,98.3 49.28,96.27
  other vias: 40.72,86.56 43.76,86.56 44.78,86.56 45.8,86.56 46.81,86.56 47.83,86.56 48.84,86.56 49.86,86.56 50.88,86.56 51.89,86.56 52.91,86.56 53.92,86.56 54.94,86.56 55.96,86.56 56.97,86.56 57.86,86.56
  pour Top (isolate 0.305, rank 2, no thermals): 40.49,86.36 58.06,86.36 58.06,97.99 53.21,97.99 53.21,87.17 50.42,87.17 50.42,96.9 48.13,96.9 48.13,87.17 45.34,87.17 45.34,97.99 40.49,97.99
  pour Bottom (isolate 0.305, rank 2): 44.96,106.93 53.59,106.93 53.59,98.81 59.69,98.81 59.69,85.34 38.86,85.34 38.86,98.81 44.96,98.81
  cutout Bottom (isolate 0.305, rank 2): 51.56,102.62 arc90 49.28,104.9 arc90 46.99,102.62 arc90 49.28,100.33 arc90
D1_COIL  (via drill 0.3, 0.51)  (2 unrouted)
  Top 0.381: RF1.P$2 arc90 7.11,57.93 RS1.P$2 arc-90 RS1.P$2 v7.11,61.47
  Top 0.61: U1.6 15.85,53.47 arc-18 18.29,53.09 arc-38 19.3,52.32 arc-33 LW3.T1
  Top 1.016: RS1.P$2 v20.07,60.2
  Top 1.27: LW3.T1 arc15 21.64,42.29 4.46,36.03 arc50 36.03,4.46 42.9,23.31 arc-50 23.31,42.9 arc-35 v22.45,62.58 | v65.31,84.89 arc-50 84.89,65.31 103.75,72.17 arc50 72.17,103.75 v65.92,86.56
  Route15 1.27: v65.92,86.56 arc54 64.26,86.36 61.6,84.17 arc86 24.63,63.68 v22.45,62.58
  Bottom 0.381: v7.11,61.47 CON4.P$1
  Bottom 1.27: v65.31,84.89 63.42,83.66 arc93 24.17,62.12 24.05,61.65 arc-44 22.91,60.45 arc-24 21.16,60.2 v20.07,60.2
D2_COIL  (via drill 0.3, 0.51)  (1 unrouted)
  Top 0.381: RF2.P$2 arc90 101.09,50.28 RS2.P$2 arc-90 RS2.P$2 v101.09,46.74
  Top 0.61: U2.6 93.98,54.74 arc-35 89.92,56.01 arc-7 v88.52,57.11
  Top 1.016: 87.83,46.62 arc-74 89.66,48.01 RS2.P$2
  Top 1.27: v42.9,84.89 arc50 23.31,65.31 4.46,72.17 arc-50 36.03,103.75 v39.16,95.16 | 87.83,46.62 arc-7 86.56,42.29 103.75,36.03 arc-50 72.17,4.46 65.31,23.31 arc50 84.89,42.9 arc35 v85.75,62.58
  Route15 1.27: v85.75,62.58 arc45 70.48,82.48 70.11,94.75 arc42 v39.16,95.16 | v88.52,57.11 84.36,60.81 arc50 68.41,81.59 67.75,93.73 arc39 39.77,93.48 42.45,86.12 v42.9,84.89
  Bottom 0.381: v101.09,46.74 CON6.P$1
GND  (via drill 0.3)  (2 unrouted)
  other vias: 48.77,3.05 50.04,1.27 57.66,8.89 51.31,13.46 65.53,6.86 65.53,4.83 56.64,3.56 44.96,5.08 45.21,9.14 53.59,1.02 57.66,11.94 59.94,13.72 58.42,1.27 62.99,1.78 57.15,12.95 58.67,11.43 58.67,10.41 57.66,10.92 57.66,9.91 58.93,14.73 61.21,10.16 61.21,11.43 60.96,12.7 51.31,12.45 51.31,11.43 51.31,10.41 51.31,9.4 51.56,8.38 56.64,10.41 56.64,9.4 56.64,11.43 3.05,59.44 1.27,58.17 8.89,50.55 13.46,56.9 6.86,42.67 4.83,42.67 3.56,51.56 5.08,63.25 9.14,62.99 1.02,54.61 11.94,50.55 13.72,48.26 1.27,49.78 1.78,45.21 12.95,51.05 11.43,49.53 10.41,49.53 10.92,50.55 9.91,50.55 14.73,49.28 10.16,46.99 11.43,46.99 12.7,47.24 12.45,56.9 11.43,56.9 10.41,56.9 9.4,56.9 8.38,56.64 10.41,51.56 9.4,51.56 11.43,51.56 105.16,48.77 106.93,50.04 99.31,57.66 94.74,51.31 101.35,65.53 103.38,65.53 104.65,56.64 103.12,44.96 99.06,45.21 107.19,53.59 96.27,57.66 94.49,59.94 106.93,58.42 106.43,62.99 95.25,57.15 96.77,58.67 97.79,58.67 97.28,57.66 98.3,57.66 93.47,58.93 98.04,61.21 96.77,61.21 95.5,60.96 106.17,43.43 96.77,51.31 97.79,51.31 98.81,51.31 99.82,51.56 97.79,56.64 98.81,56.64 96.77,56.64
  pour Top (isolate 0.305, rank 6, no thermals): 42.16,0 66.04,0 66.04,14.99 42.16,14.99
  pour Bottom (isolate 0.305, rank 6, no thermals): 42.16,0 66.04,0 66.04,14.99 42.16,14.99
  cutout Bottom (isolate 0.305, rank 5): 52.83,3.05 51.31,3.05 51.31,2.03 52.83,2.03
  cutout Bottom (isolate 0.305, rank 5): 45.72,7.62 44.2,7.62 44.2,6.6 45.72,6.6
  cutout Top (isolate 0.305, rank 5): 53.59,5.84 53.59,3.81 54.61,3.81 54.61,5.84 55.37,5.84 55.37,8.38 52.83,8.38 52.83,5.84
  cutout Top (isolate 0.305, rank 5): 49.53,6.1 51.05,6.1 51.05,6.6 49.02,6.6 49.02,6.35
  cutout Bottom (isolate 0.305, rank 5): 55.37,8.38 52.83,8.38 52.83,5.84 55.37,5.84
  cutout Bottom (isolate 0.305, rank 5): 54.1,13.97 54.1,11.43 55.37,11.43 55.37,13.97
  cutout Top (isolate 0.305, rank 5): 54.1,15.24 54.1,11.43 55.37,11.43 55.37,15.24
  pour Top (isolate 0.305, rank 6, no thermals): 0,66.04 0,42.16 14.99,42.16 14.99,66.04
  pour Bottom (isolate 0.305, rank 6, no thermals): 0,66.04 0,42.16 14.99,42.16 14.99,66.04
  cutout Bottom (isolate 0.305, rank 5): 3.05,55.37 3.05,56.9 2.03,56.9 2.03,55.37
  cutout Bottom (isolate 0.305, rank 5): 7.62,62.48 7.62,64.01 6.6,64.01 6.6,62.48
  cutout Top (isolate 0.305, rank 5): 5.84,54.61 3.81,54.61 3.81,53.59 5.84,53.59 5.84,52.83 8.38,52.83 8.38,55.37 5.84,55.37
  cutout Top (isolate 0.305, rank 5): 6.1,58.67 6.1,57.15 6.6,57.15 6.6,59.18 6.35,59.18
  cutout Bottom (isolate 0.305, rank 5): 8.38,52.83 8.38,55.37 5.84,55.37 5.84,52.83
  cutout Bottom (isolate 0.305, rank 5): 13.97,54.1 11.43,54.1 11.43,52.83 13.97,52.83
  cutout Top (isolate 0.305, rank 5): 15.24,54.1 11.43,54.1 11.43,52.83 15.24,52.83
  pour Top (isolate 0.305, rank 6, no thermals): 108.2,42.16 108.2,66.04 93.22,66.04 93.22,42.16
  pour Bottom (isolate 0.305, rank 6, no thermals): 108.2,42.16 108.2,66.04 93.22,66.04 93.22,42.16
  cutout Bottom (isolate 0.305, rank 5): 105.16,52.83 105.16,51.31 106.17,51.31 106.17,52.83
  cutout Bottom (isolate 0.305, rank 5): 100.58,45.72 100.58,44.2 101.6,44.2 101.6,45.72
  cutout Top (isolate 0.305, rank 5): 102.36,53.59 104.39,53.59 104.39,54.61 102.36,54.61 102.36,55.37 99.82,55.37 99.82,52.83 102.36,52.83
  cutout Top (isolate 0.305, rank 5): 102.11,49.53 102.11,51.05 101.6,51.05 101.6,49.02 101.85,49.02
  cutout Bottom (isolate 0.305, rank 5): 99.82,55.37 99.82,52.83 102.36,52.83 102.36,55.37
  cutout Bottom (isolate 0.305, rank 5): 94.23,54.1 96.77,54.1 96.77,55.37 94.23,55.37
  cutout Top (isolate 0.305, rank 5): 92.96,54.1 96.77,54.1 96.77,55.37 92.96,55.37
N$1
  Top 0.381: RG.P$1 arc-90 RG.P$1 | RF.P$1 arc90 50.31,5.33 RG.P$1 | U3.2 53.47,5.45 arc-90 RG.P$1
N$3
  Top 0.381: C5.P$2 54.87,5.33 | C5.P$2 54.74,5.45 U3.3 | C5.P$2 R1.P$2
N$4  (via drill 0.3)
  Top 0.381: v54.86,3.3 C5.P$1
  Bottom 0.381: CON2.P$1 54.1,2.54 arc90 v54.86,3.3
N$5
  Top 0.381: 5.33,54.87 arc-90 RG1.P$1 | RF1.P$1 arc90 5.33,57.89 RG1.P$1 | U1.2 5.45,54.74 arc-90 RG1.P$1
N$6
  Top 0.381: RG.P$2 arc-90 53.19,4.18 LG.P$2
N$7
  Top 0.381: C10.P$2 | C10.P$2 5.45,53.47 U1.3 | C10.P$2 R2.P$2
N$8  (via drill 0.3)
  Top 0.381: v3.3,53.34 C10.P$1
  Bottom 0.381: CON3.P$1 2.54,54.1 arc90 v3.3,53.34
N$10
  Top 0.381: RG1.P$2 arc-90 4.18,55.01 LG1.P$2
N$11
  Top 0.381: RG2.P$1 arc-90 RG2.P$1 | RF2.P$1 arc90 102.88,50.31 RG2.P$1 | U2.2 102.75,53.47 arc-90 RG2.P$1
N$12
  Top 0.381: C15.P$2 102.87,54.87 | C15.P$2 102.75,54.74 U2.3 | C15.P$2 R3.P$2
N$13  (via drill 0.3)
  Top 0.381: v104.9,54.86 C15.P$1
  Bottom 0.381: CON5.P$1 105.66,54.1 arc90 v104.9,54.86
N$15
  Top 0.381: RG2.P$2 arc-90 104.03,53.19 LG2.P$2
R_COIL  (via drill 0.3, 0.35)  (1 unrouted)
  Top 0.381: RF.P$2 arc90 50.28,7.11 RS.P$2 arc-90 RS.P$2 v46.74,7.11
  Top 0.61: U3.6 v54.74,16.71
  Top 1.016: RS.P$2 48.01,13.46 arc-81 51.05,17.02 51.59,17.07 arc81 54.74,20.34 arc6 v54.74,21.54
  Route2 0.61: 55.86,23.16 55.88,23.11 | v54.74,16.71 54.74,18.57 arc49 54.18,19.81 arc-46 53.57,21.07 arc-6 53.57,21.54 arc80 52.34,23.16
  Route2 1.016: 55.88,23.11 arc72 v54.74,21.54
  Route2 1.27: 55.86,23.16 arc353 52.34,23.16
  Bottom 0.381: v46.74,7.11 CON1.P$1